# Altium schematic sheet Motor Driver Schematic_2.SchDoc
size A
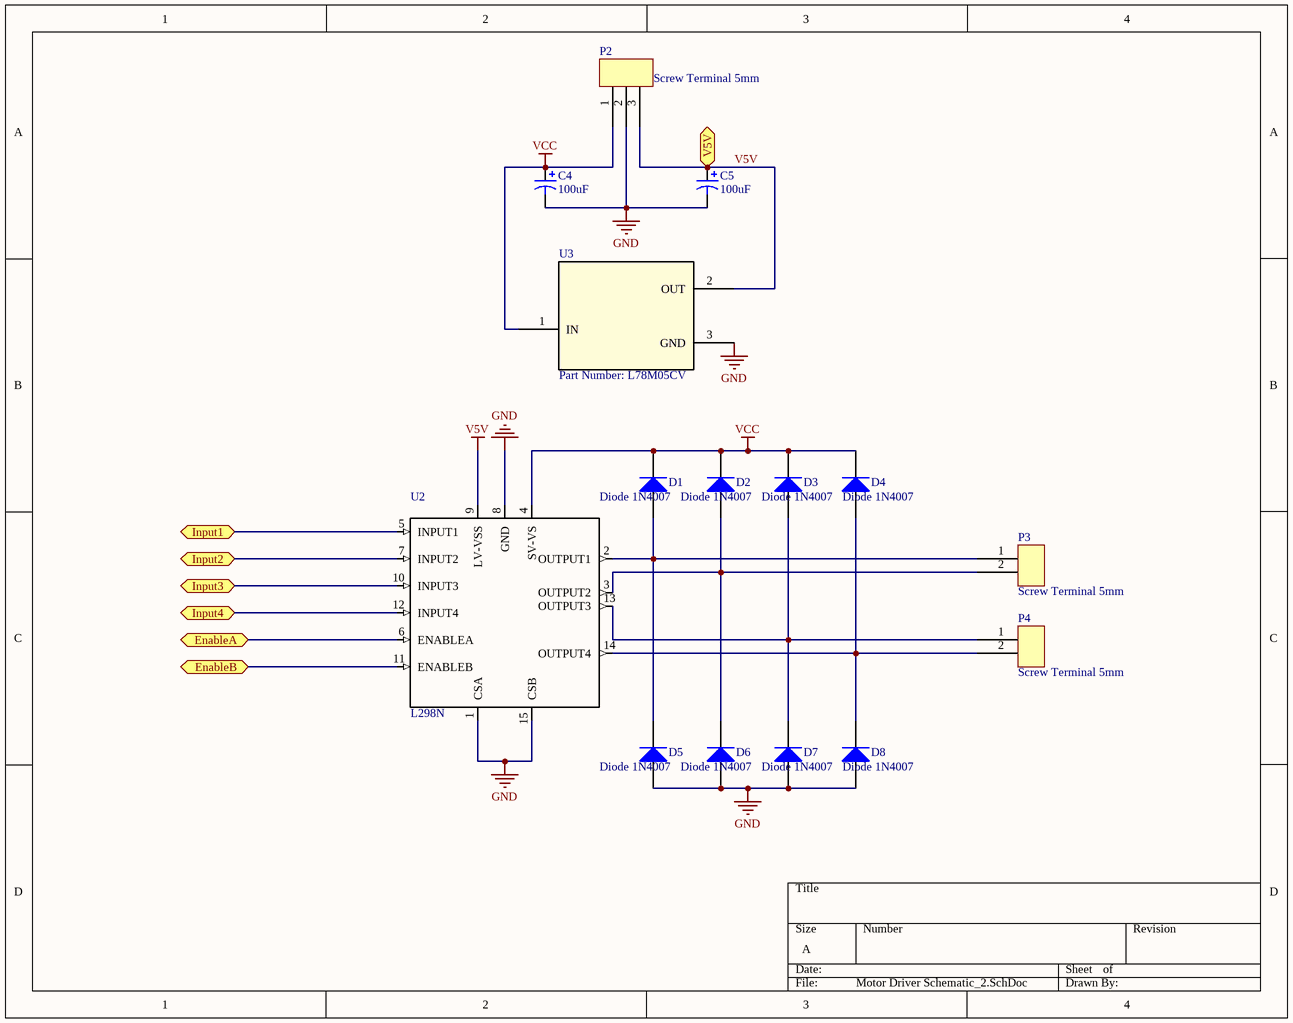
[diagram p0: Motor Driver Schematic_2.SchDoc]

## Parts
C4  value 100uF  [RB7.6-15]  (hidden comment: Cap Pol1)
C5  value 100uF  [RB7.6-15]  (hidden comment: Cap Pol1)
D1  Diode 1N4007  [DO-41]
D2  Diode 1N4007  [DO-41]
D3  Diode 1N4007  [DO-41]
D4  Diode 1N4007  [DO-41]
D5  Diode 1N4007  [DO-41]
D6  Diode 1N4007  [DO-41]
D7  Diode 1N4007  [DO-41]
D8  Diode 1N4007  [DO-41]
P2  Screw Terminal 5mm  [PCBComponent_1]
P3  Screw Terminal 5mm  [PCBComponent_1]
P4  Screw Terminal 5mm  [PCBComponent_1]
U2  L298N  [DRIVER_L298N]
U3  Part Number: L78M05CV  [TO-220]

## Ports
EnableA, EnableB, Input1, Input2, Input3, Input4, V5V

## Nets
GND: C4.2 C5.2 D5.1(A) D6.1(A) D7.1(A) D8.1(A) P2.2 U2.1(CSA) U2.8(GND) U2.15(CSB) U3.3(GND)
V5V: C5.1 P2.3 U2.9(LV-VSS) U3.2(OUT) ; port V5V
VCC: C4.1 D1.2(K) D2.2(K) D3.2(K) D4.2(K) P2.1 U2.4(SV-VS) U3.1(IN)
EnableA: U2.6(ENABLEA) ; port EnableA
EnableB: U2.11(ENABLEB) ; port EnableB
Input1: U2.5(INPUT1) ; port Input1
Input2: U2.7(INPUT2) ; port Input2
Input3: U2.10(INPUT3) ; port Input3
Input4: U2.12(INPUT4) ; port Input4
NetD1_1: D1.1(A) D5.2(K) P3.1 U2.2(OUTPUT1)
NetD2_1: D2.1(A) D6.2(K) P3.2 U2.3(OUTPUT2)
NetD3_1: D3.1(A) D7.2(K) P4.1 U2.13(OUTPUT3)
NetD4_1: D4.1(A) D8.2(K) P4.2 U2.14(OUTPUT4)

## Library data of the parts
C4 C5 = Cap Pol1: Polarized Capacitor (Radial); Published: 8-Jun-2000; LatestRevisionDate: 17-Jul-2002; LatestRevisionNote: Re-released for DXP Platform.; PackageReference: RB7.6-15; Publisher: Altium Limited; PackageDescription: Polarized Capacitor (Radial); 2 Leads
D1-D8 = Diode 1N4007: 1 Amp General Purpose Rectifier; Published: 8-Jun-2000; LatestRevisionDate: 17-Jul-2002; LatestRevisionNote: Re-released for DXP Platform.; DatasheetVersion: 1998; PackageVersion: Aug-1999; PackageReference: DO-41; Publisher: Altium Limited; PackageDescription: Diode, Axial; Body 5.2 x 2.7 mm (LxDia. max), Lead Dia. 0.86 mm (max); Code_JEDEC: DO-204-AL; ComponentLink1Description: Manufacturer Link; ComponentLink1URL: http://www.fairchildsemi.com/; ComponentLink2Description: Datasheet; ComponentLink2URL: http://www.fairchildsemi.com/ds/1N%2F1N4001.pdf
P2 = Screw Terminal 5mm 3pin: Screw Terminal 5mm 3 pin
P3 P4 = Screw Terminal 5mm 2pin
U2 = L298N: MF: STMicroelectronics; MP: L298N; Availability: Unavailable; Package: Multiwatt-15 STMicroelectronics; SnapEDA_Link: https://www.snapeda.com/parts/L298N/STMicroelectronics/view-part/?ref=snap; Price: None; Value: *
U3 = L78M05CV: No Description Available; Built_By: EMA_UL_Team; VENDOR: STMicroelectronics; MANUFACTURER_PART_NUMBER: L78M05CV; Copyright: Copyright (C) 2018 Accelerated Designs. All rights reserved; RefDes: RefDes; Type: DEV; Value: Value